# Altium schematic sheet Main.SchDoc
size A
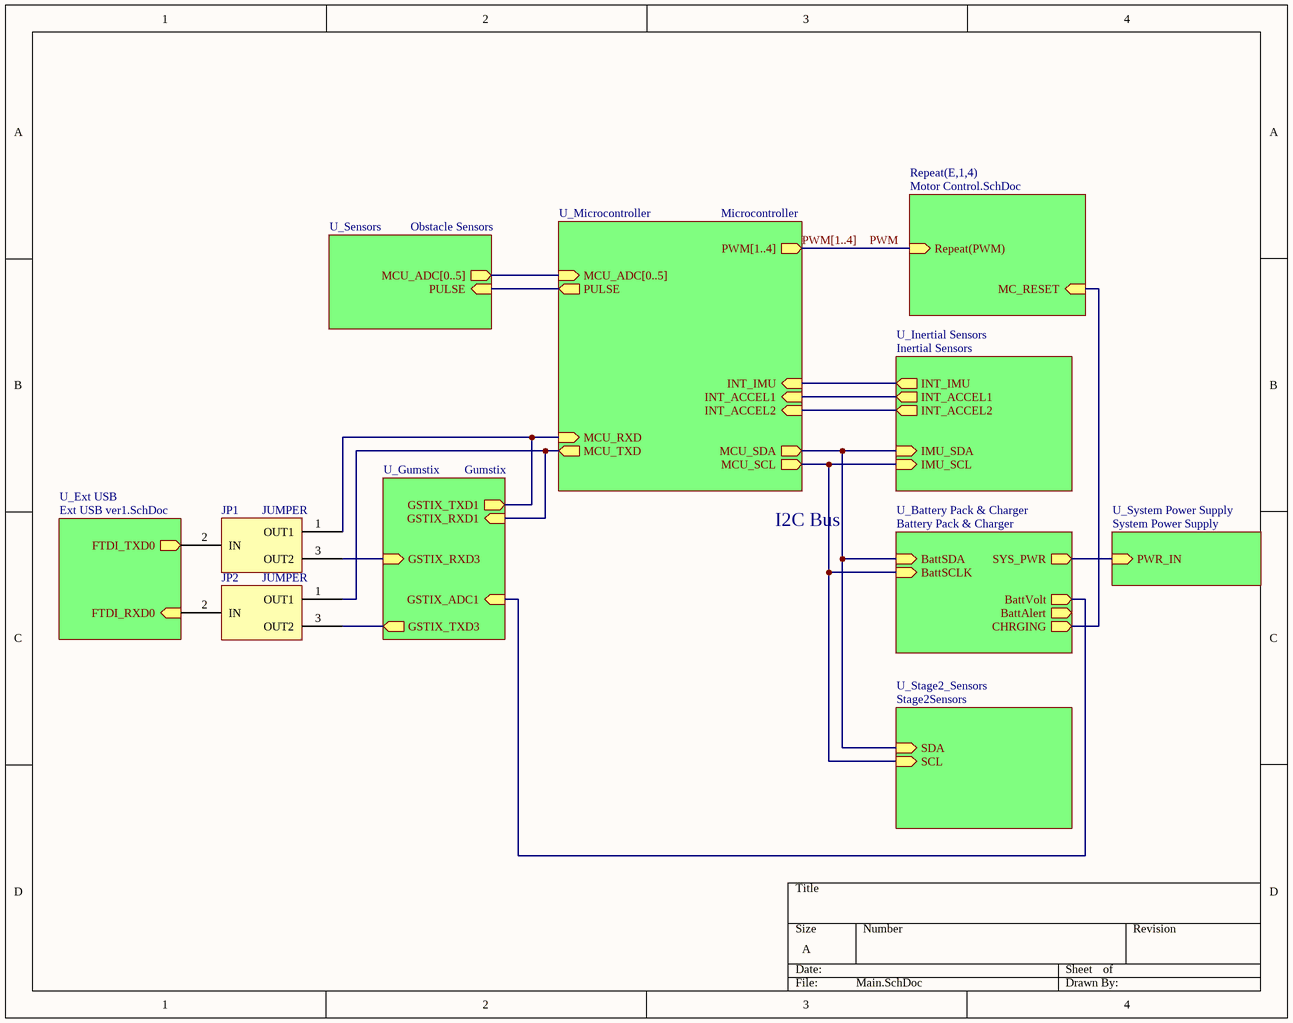
[diagram p0: Main.SchDoc]

## Parts
JP1  JUMPER  [JUMPER]
JP2  JUMPER  [JUMPER]

## Sub-sheets
Repeat(E,1,4) = Motor Control.SchDoc: Repeat(PWM) (in), MC_RESET (in)
U_Battery Pack & Charger = Battery Pack & Charger: BattVolt (out), BattAlert (out), BattSCLK (in), BattSDA (in), SYS_PWR (out), CHRGING (out)
U_Ext USB = Ext USB ver1.SchDoc: FTDI_RXD0 (in), FTDI_TXD0 (out)
U_Gumstix = Gumstix: GSTIX_RXD3 (in), GSTIX_TXD3 (out), GSTIX_RXD1 (in), GSTIX_TXD1 (out), GSTIX_ADC1 (in)
U_Inertial Sensors = Inertial Sensors: IMU_SDA (in), IMU_SCL (in), INT_IMU (out), INT_ACCEL1 (out), INT_ACCEL2 (out)
U_Microcontroller = Microcontroller: PWM[1..4] (out), MCU_SDA (out), MCU_SCL (out), INT_IMU (in), INT_ACCEL1 (in), INT_ACCEL2 (in), MCU_ADC[0..5] (in), MCU_RXD (in), MCU_TXD (out), PULSE (out)
U_Sensors = Obstacle Sensors: MCU_ADC[0..5] (out), PULSE (in)
U_Stage2_Sensors = Stage2Sensors: SCL (in), SDA (in)
U_System Power Supply = System Power Supply: PWR_IN (in)

## Nets
PWM: sheet Repeat(E,1,4)/Repeat(PWM)
NetJP1_1: JP1.1(OUT1) ; sheet U_Microcontroller/MCU_RXD, sheet U_Gumstix/GSTIX_TXD1
NetJP1_2: JP1.2(IN) ; sheet U_Ext USB/FTDI_TXD0
NetJP1_3: JP1.3(OUT2) ; sheet U_Gumstix/GSTIX_RXD3
NetJP2_1: JP2.1(OUT1) ; sheet U_Microcontroller/MCU_TXD, sheet U_Gumstix/GSTIX_RXD1
NetJP2_2: JP2.2(IN) ; sheet U_Ext USB/FTDI_RXD0
NetJP2_3: JP2.3(OUT2) ; sheet U_Gumstix/GSTIX_TXD3
(unnamed): sheet Repeat(E,1,4)/MC_RESET, sheet U_Battery Pack & Charger/CHRGING
(unnamed): sheet U_System Power Supply/PWR_IN, sheet U_Battery Pack & Charger/SYS_PWR
(unnamed): sheet U_Inertial Sensors/IMU_SDA, sheet U_Microcontroller/MCU_SDA, sheet U_Battery Pack & Charger/BattSDA, sheet U_Stage2_Sensors/SDA
(unnamed): sheet U_Inertial Sensors/IMU_SCL, sheet U_Microcontroller/MCU_SCL, sheet U_Battery Pack & Charger/BattSCLK, sheet U_Stage2_Sensors/SCL
(unnamed): sheet U_Inertial Sensors/INT_IMU, sheet U_Microcontroller/INT_IMU
(unnamed): sheet U_Inertial Sensors/INT_ACCEL1, sheet U_Microcontroller/INT_ACCEL1
(unnamed): sheet U_Inertial Sensors/INT_ACCEL2, sheet U_Microcontroller/INT_ACCEL2
(unnamed): sheet U_Sensors/PULSE, sheet U_Microcontroller/PULSE
(unnamed): sheet U_Gumstix/GSTIX_ADC1, sheet U_Battery Pack & Charger/BattVolt

## Buses and harness runs
bus PWM[1..4] = sheet U_Microcontroller/PWM[1..4]
bus sheet U_Microcontroller/MCU_ADC[0..5] = sheet U_Sensors/MCU_ADC[0..5]

## Notes on the sheet
- I2C Bus